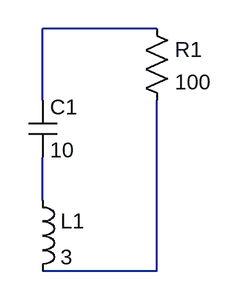
[diagram p0: schematic simple_annotated.asc]
simple_annotated.asc, the LTspice schematic file:
Version 4
SHEET 1 880 680
WIRE 272 272 144 272
WIRE 144 352 144 272
WIRE 144 464 144 416
WIRE 272 544 272 352
WIRE 272 544 144 544
SYMBOL cap 128 352 R0
SYMATTR InstName C1
SYMATTR Value 10
SYMBOL ind 128 448 R0
SYMATTR InstName L1
SYMATTR Value 3
SYMBOL res 256 256 R0
SYMATTR InstName R1
SYMATTR Value 100

The netlist it stands for:
* simple_annotated.asc
C1 N001 N002 10
L1 N002 N003 3
R1 N001 N003 100
.backanno
.end